# Altium project Arduino_Due.PrjPCB
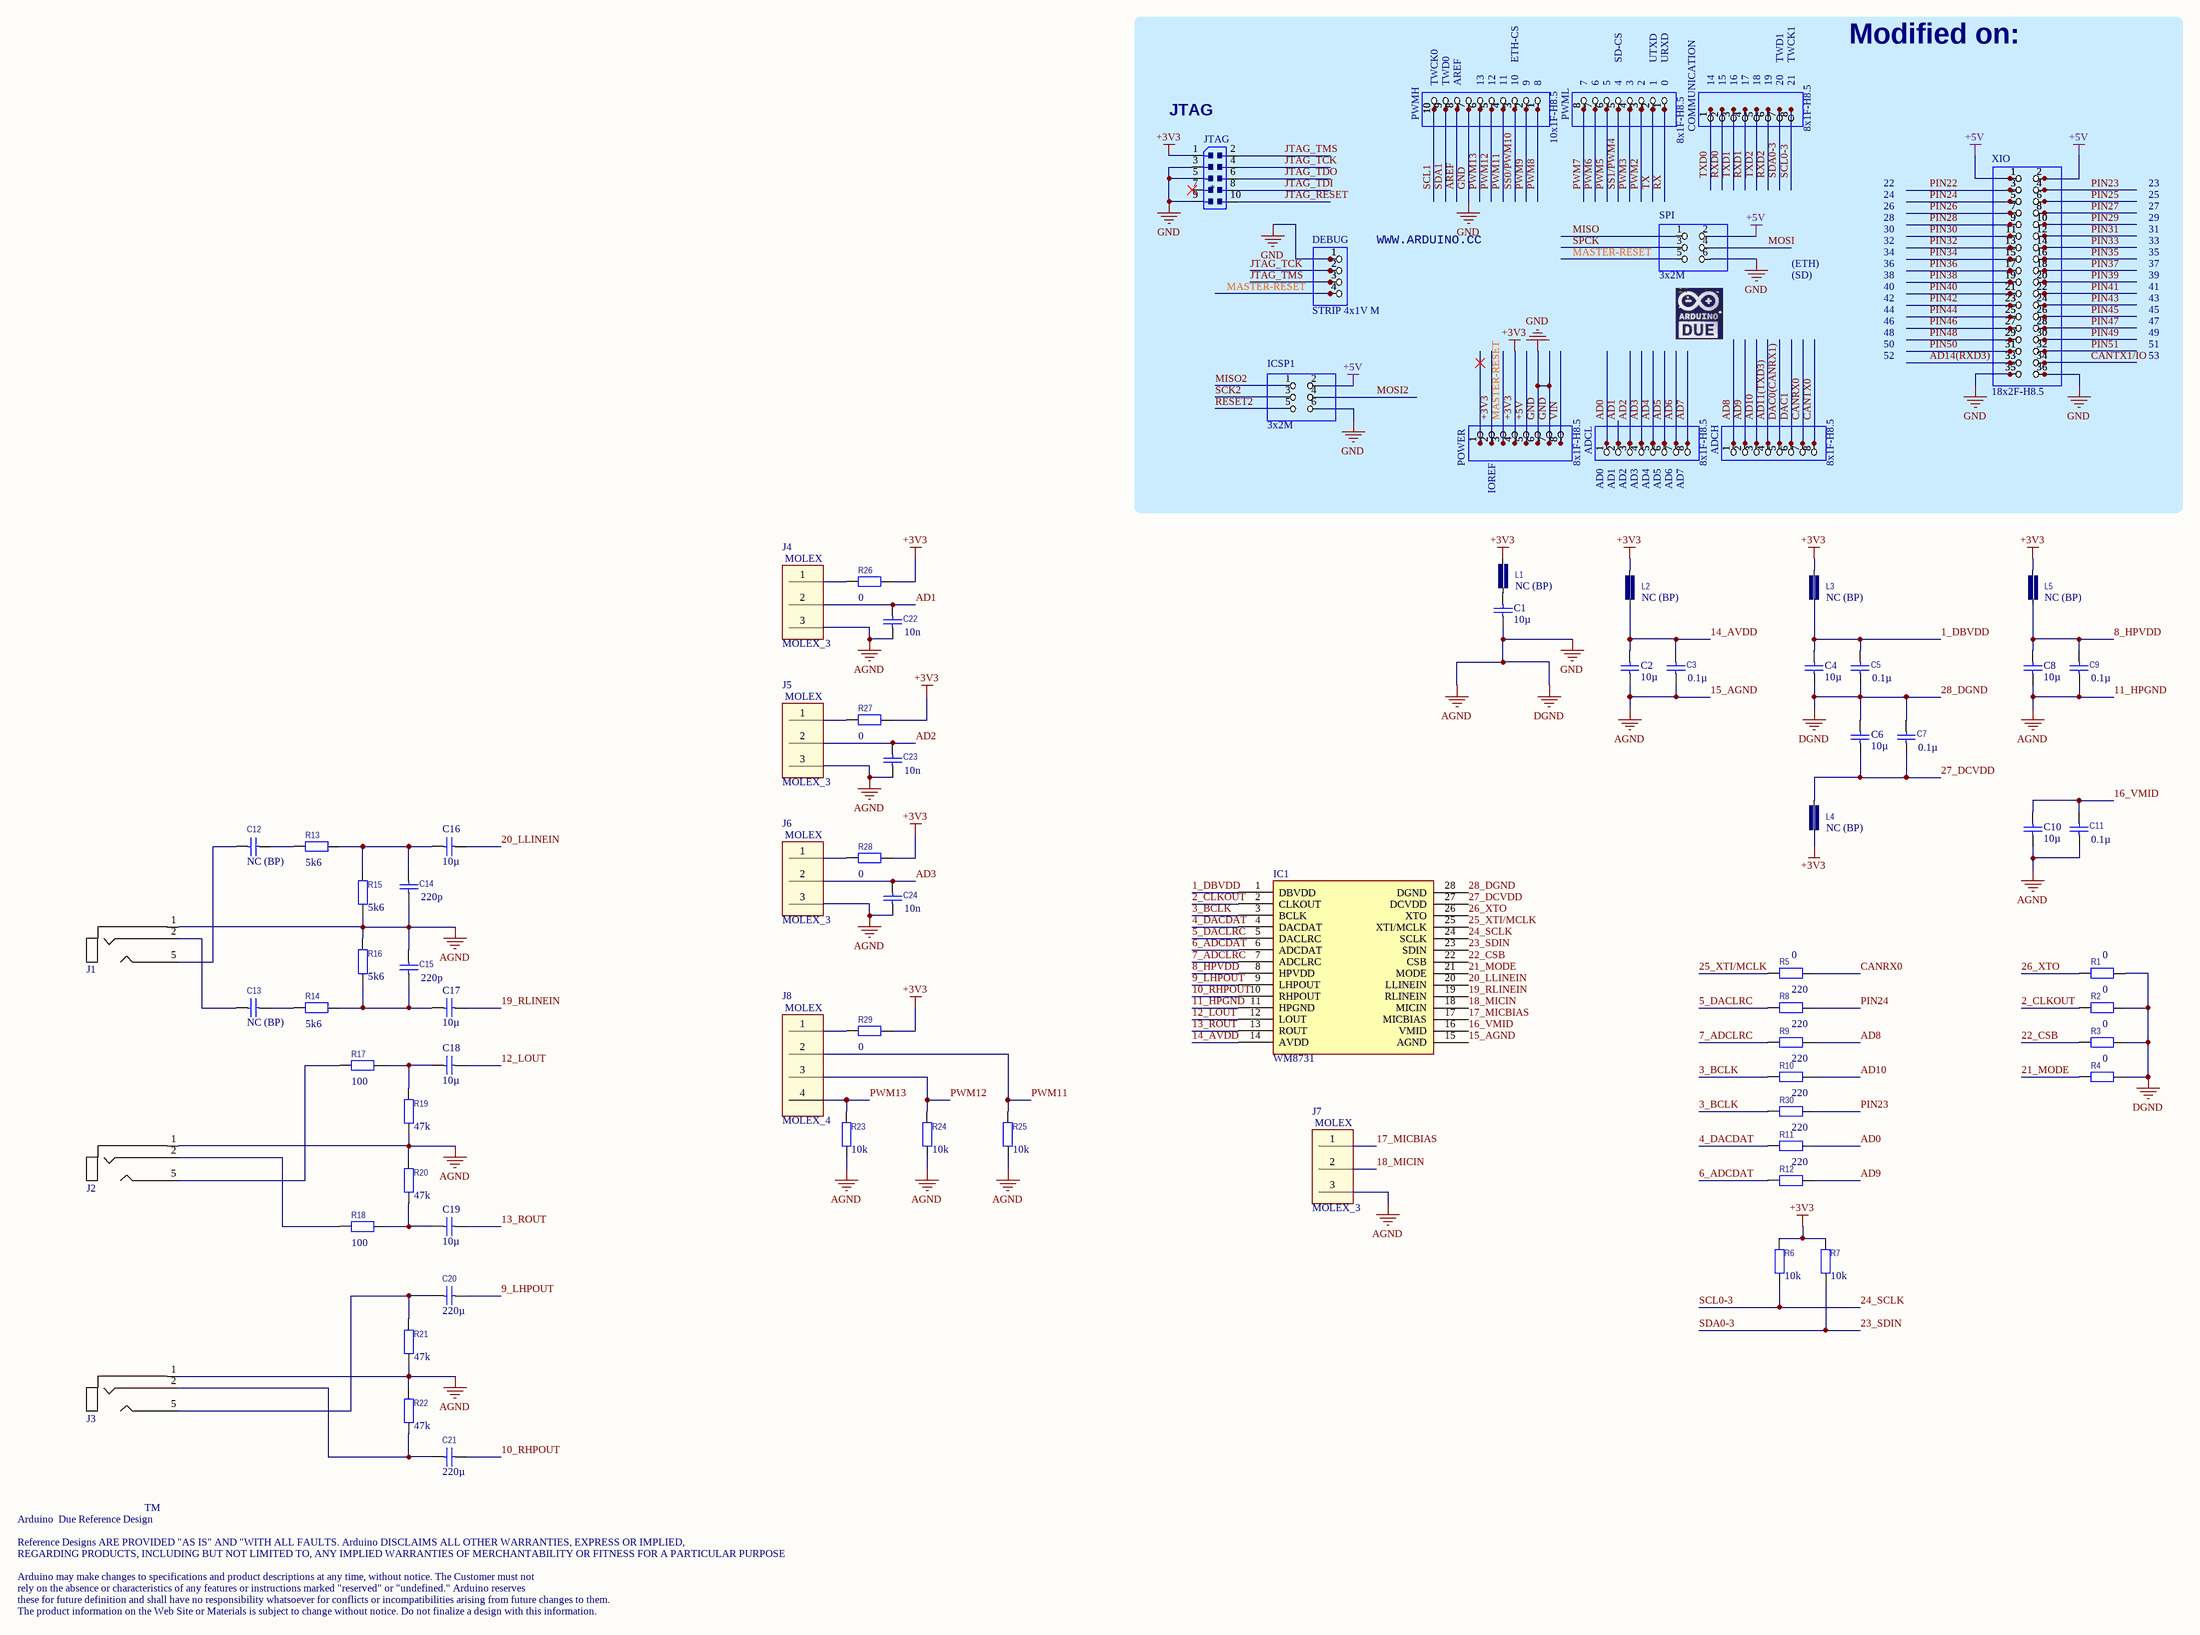
[diagram p0: Arduino_DUE_V02b_1.SchDoc]
1 sheet, 79 parts. Net scope: global (net labels, ports and power ports of the same name join across sheets).
Board file: Arduino_DUE_V02c.PcbDoc

## Sheet Arduino_DUE_V02b_1.SchDoc
size C

### Parts
ADCH  8x1F-H8.5  [1X08]
ADCL  8x1F-H8.5  [1X08]
C1  value 10µ  [0603_s]  (hidden comment: Cap)
C2  value 10µ  [0603_s]  (hidden comment: Cap)
C3  value 0.1µ  [0402_s]  (hidden comment: Capacitor)
C4  value 10µ  [0603_s]  (hidden comment: Cap)
C5  value 0.1µ  [0402_s]  (hidden comment: Capacitor)
C6  value 10µ  [0603_s]  (hidden comment: Cap)
C7  value 0.1µ  [0402_s]  (hidden comment: Capacitor)
C8  value 10µ  [0603_s]  (hidden comment: Cap)
C9  value 0.1µ  [0402_s]  (hidden comment: Capacitor)
C10  value 10µ  [0603_s]  (hidden comment: Cap)
C11  value 0.1µ  [0402_s]  (hidden comment: Capacitor)
C12  value NC (BP)  [0402_s]  (hidden comment: Capacitor)
C13  value NC (BP)  [0402_s]  (hidden comment: Capacitor)
C14  value 220p  [0402_s]  (hidden comment: Capacitor)
C15  value 220p  [0402_s]  (hidden comment: Capacitor)
C16  value 10µ  [0603_s]  (hidden comment: Cap)
C17  value 10µ  [0603_s]  (hidden comment: Cap)
C18  value 10µ  [0603_s]  (hidden comment: Cap)
C19  value 10µ  [0603_s]  (hidden comment: Cap)
C20  value 220µ  [EEEFK0J221P]  (hidden comment: Capacitor)
C21  value 220µ  [EEEFK0J221P]  (hidden comment: Capacitor)
C22  value 10n  [0402_s]  (hidden comment: Capacitor)
C23  value 10n  [0402_s]  (hidden comment: Capacitor)
C24  value 10n  [0402_s]  (hidden comment: Capacitor)
COMMUNICATION  8x1F-H8.5  [1X08]
DEBUG  STRIP 4x1V M  [1X04]
IC1  WM8731  [SSOP28]
ICSP1  3x2M  [2X03]
J1  FC68131  [FC68131]  (value not drawn)
J2  FC68131  [FC68131]  (value not drawn)
J3  FC68131  [FC68131]  (value not drawn)
J4  MOLEX_3  [254_3]
J5  MOLEX_3  [254_3]
J6  MOLEX_3  [254_3]
J7  MOLEX_3  [254_3]
J8  MOLEX_4  [254_4]
JTAG  *  [PINHEAD_2X05_127]
L1  value NC (BP)  [0402_S]
L2  value NC (BP)  [0402_S]
L3  value NC (BP)  [0402_S]
L4  value NC (BP)  [0402_S]
L5  value NC (BP)  [0402_S]
POWER  8x1F-H8.5  [1X08]
PWMH  10x1F-H8.5  [1X10]
PWML  8x1F-H8.5  [1X08]
R1  value 0  [0402_s]
R2  value 0  [0402_s]
R3  value 0  [0402_s]
R4  value 0  [0402_s]
R5  value 0  [0402_s]
R6  value 10k  [0402_s]
R7  value 10k  [0402_s]
R8  value 220  [0402_s]
R9  value 220  [0402_s]
R10  value 220  [0402_s]
R11  value 220  [0402_s]
R12  value 220  [0402_s]
R13  value 5k6  [0402_s]
R14  value 5k6  [0402_s]
R15  value 5k6  [0402_s]
R16  value 5k6  [0402_s]
R17  value 100  [0402_s]
R18  value 100  [0402_s]
R19  value 47k  [0402_s]
R20  value 47k  [0402_s]
R21  value 47k  [0402_s]
R22  value 47k  [0402_s]
R23  value 10k  [0402_s]
R24  value 10k  [0402_s]
R25  value 10k  [0402_s]
R26  value 0  [0402_s]
R27  value 0  [0402_s]
R28  value 0  [0402_s]
R29  value 0  [0402_s]
R30  value 220  [0402_s]
SPI  3x2M  [2X03]
XIO  18x2F-H8.5  [2X18]

### Blocks framed on the sheet
Modified on:: ADCH ADCL COMMUNICATION DEBUG ICSP1 JTAG POWER PWMH PWML SPI XIO

### Nets
11_HPGND: C1.1 C2.1 C3.1 C4.1 C5.1 C6.2 C7.2 C8.1 C9.1 C10.1 C11.1 C14.1 C15.2 C22.1 C23.1 C24.1 DEBUG.1 IC1.11(HPGND) IC1.15(AGND) IC1.28(DGND) ICSP1.6 J1.1 J2.1 J3.1 J4.3 J5.3 J6.3 J7.3 JTAG.3 JTAG.5 JTAG.9 POWER.6 POWER.7 PWMH.7 R1.2 R2.2 R3.2 R4.2 R15.1 R16.2 R19.1 R20.2 R21.1 R22.2 R23.1 R24.1 R25.1 SPI.6 XIO.35 XIO.36  [also labelled 15_AGND, 28_DGND, AGND, DGND, GND]
+3V3: JTAG.1 L1.2 L2.2 L3.2 L4.1 L5.2 POWER.2 POWER.4 R6.2 R7.2 R26.1 R27.1 R28.1 R29.1
+5V: ICSP1.2 POWER.5 SPI.2 XIO.1 XIO.2
1_DBVDD: C4.2 C5.2 IC1.1(DBVDD) L3.1
2_CLKOUT: IC1.2(CLKOUT) R2.1
3_BCLK: IC1.3(BCLK) R10.1 R30.1
4_DACDAT: IC1.4(DACDAT) R11.1
5_DACLRC: IC1.5(DACLRC) R8.1
6_ADCDAT: IC1.6(ADCDAT) R12.1
7_ADCLRC: IC1.7(ADCLRC) R9.1
8_HPVDD: C8.2 C9.2 IC1.8(HPVDD) L5.1
9_LHPOUT: C20.1 IC1.9(LHPOUT)
10_RHPOUT: C21.1 IC1.10(RHPOUT)
12_LOUT: C18.1 IC1.12(LOUT)
13_ROUT: C19.1 IC1.13(ROUT)
14_AVDD: C2.2 C3.2 IC1.14(AVDD) L2.1
16_VMID: C10.2 C11.2 IC1.16(VMID)
17_MICBIAS: IC1.17(MICBIAS) J7.1
18_MICIN: IC1.18(MICIN) J7.2
19_RLINEIN: C17.1 IC1.19(RLINEIN)
20_LLINEIN: C16.1 IC1.20(LLINEIN)
21_MODE: IC1.21(MODE) R4.1
22_CSB: IC1.22(CSB) R3.1
23_SDIN: COMMUNICATION.7 IC1.23(SDIN) R7.1  [also labelled SDA0-3]
24_SCLK: COMMUNICATION.8 IC1.24(SCLK) R6.1  [also labelled SCL0-3]
25_XTI/MCLK: IC1.25(XTI/MCLK) R5.1
26_XTO: IC1.26(XTO) R1.1
27_DCVDD: C6.1 C7.1 IC1.27(DCVDD) L4.2
AD0: ADCL.1 R11.2
AD1: ADCL.2 C22.2 J4.2
AD2: ADCL.3 C23.2 J5.2
AD3: ADCL.4 C24.2 J6.2
AD4: ADCL.5
AD5: ADCL.6
AD6: ADCL.7
AD7: ADCL.8
AD8: ADCH.1 R9.2
AD9: ADCH.2 R12.2
AD10: ADCH.3 R10.2
AD11(TXD3): ADCH.4
AD14(RXD3): XIO.33
AREF: PWMH.8
CANRX0: ADCH.7 R5.2
CANTX0: ADCH.8
CANTX1/IO: XIO.34
DAC0(CANRX1): ADCH.5
DAC1: ADCH.6
JTAG_RESET: JTAG.10
JTAG_TCK: DEBUG.2 JTAG.4
JTAG_TDI: JTAG.8
JTAG_TDO: JTAG.6
JTAG_TMS: DEBUG.3 JTAG.2
MASTER-RESET: DEBUG.4 POWER.3 SPI.5
MISO: SPI.1
MISO2: ICSP1.1
MOSI: SPI.4
MOSI2: ICSP1.4
PIN22: XIO.3
PIN23: R30.2 XIO.4
PIN24: R8.2 XIO.5
PIN25: XIO.6
PIN26: XIO.7
PIN27: XIO.8
PIN28: XIO.9
PIN29: XIO.10
PIN30: XIO.11
PIN31: XIO.12
PIN32: XIO.13
PIN33: XIO.14
PIN34: XIO.15
PIN35: XIO.16
PIN36: XIO.17
PIN37: XIO.18
PIN38: XIO.19
PIN39: XIO.20
PIN40: XIO.21
PIN41: XIO.22
PIN42: XIO.23
PIN43: XIO.24
PIN44: XIO.25
PIN45: XIO.26
PIN46: XIO.27
PIN47: XIO.28
PIN48: XIO.29
PIN49: XIO.30
PIN50: XIO.31
PIN51: XIO.32
PWM2: PWML.3
PWM3: PWML.4
PWM5: PWML.6
PWM6: PWML.7
PWM7: PWML.8
PWM8: PWMH.1
PWM9: PWMH.2
PWM11: J8.2 PWMH.4 R25.2
PWM12: J8.3 PWMH.5 R24.2
PWM13: J8.4 PWMH.6 R23.2
RESET2: ICSP1.5
RX: PWML.1
RXD0: COMMUNICATION.2
RXD1: COMMUNICATION.4
RXD2: COMMUNICATION.6
SCK2: ICSP1.3
SCL1: PWMH.10
SDA1: PWMH.9
SPCK: SPI.3
SS0/PWM10: PWMH.3
SS1/PWM4: PWML.5
TX: PWML.2
TXD0: COMMUNICATION.1
TXD1: COMMUNICATION.3
TXD2: COMMUNICATION.5
VIN: POWER.8
NetC1_2: C1.2 L1.1
NetC12_1: C12.1 R13.2
NetC12_2: C12.2 J1.5
NetC13_1: C13.1 R14.2
NetC13_2: C13.2 J1.2
NetC14_2: C14.2 C16.2 R13.1 R15.2
NetC15_1: C15.1 C17.2 R14.1 R16.1
NetC18_2: C18.2 R17.1 R19.2
NetC19_2: C19.2 R18.1 R20.1
NetC20_2: C20.2 J3.5 R21.2
NetC21_2: C21.2 J3.2 R22.1
NetJ2_2: J2.2 R18.2
NetJ2_5: J2.5 R17.2
NetJ4_1: J4.1 R26.2
NetJ5_1: J5.1 R27.2
NetJ6_1: J6.1 R28.2
NetJ8_1: J8.1 R29.2

Not connected (* = marked no-connect by the designer): JTAG 7*; POWER 1*

### Notes on the sheet
- (near PWMH) ETH-CS
- (near PWML) SD-CS
- (near PWML) UTXD
- (near PWML) URXD
- TWD1
- TWCK1
- (near JTAG) JTAG
- (near PWMH) TWCK0
- (near PWMH) TWD0
- (near PWMH) AREF
- (near PWMH) 13
- (near PWMH) 12
- (near PWMH) 11
- (near PWMH) 10
- (near PWMH) 9
- (near PWMH) 8
- (near PWML) 7
- (near PWML) 6
- (near PWML) 5
- (near PWML) 4
- (near PWML) 3
- (near PWML) 2
- (near PWML) 1
- (near PWML) 0
- 14
- 15
- (near COMMUNICATION) 16
- (near COMMUNICATION) 17
- (near COMMUNICATION) 18
- (near COMMUNICATION) 19
- (near COMMUNICATION) 20
- (near COMMUNICATION) 21
- 22
- 23
- (near DEBUG) WWW.ARDUINO.CC
- 24
- 26
- 28
- 30
- 32
- 25
- 27
- 29
- 31
- 33
- (ETH)
- (SD)
- 34
- 36
- 42
- 40
- 38
- 35
- 37
- 43
- 41
- 39
- 52
- 50
- 48
- 46
- 44
- 51
- 53
- 49
- 47
- 45
- (near POWER) IOREF
- (near ADCL) AD0
- (near ADCL) AD1
- (near ADCL) AD2
- (near ADCL) AD3
- (near ADCL) AD4
- (near ADCL) AD5
- (near ADCL) AD6
- (near ADCL) AD7
- TM
- Arduino  Due Reference Design
- Reference Designs ARE PROVIDED "AS IS" AND "WITH ALL FAULTS. Arduino DISCLAIMS ALL OTHER WARRANTIES, EXPRESS OR IMPLIED,
- REGARDING PRODUCTS, INCLUDING BUT NOT LIMITED TO, ANY IMPLIED WARRANTIES OF MERCHANTABILITY OR FITNESS FOR A PARTICULAR PURPOSE
- Arduino may make changes to specifications and product descriptions at any time, without notice. The Customer must not
- rely on the absence or characteristics of any features or instructions marked "reserved" or "undefined." Arduino reserves
- these for future definition and shall have no responsibility whatsoever for conflicts or incompatibilities arising from future changes to them.
- The product information on the Web Site or Materials is subject to change without notice. Do not finalize a design with this information.
- (in symbol MOLEX_3) MOLEX
- (in symbol MOLEX_4) MOLEX

### Library data of the parts
ADCH ADCL COMMUNICATION POWER PWML = PINHD-1X8
C3 C5 C7 C9 C11-C15 C20-C24 = EA00008430: Part_ID: 8430; Manufacturer 1: Murata Electronics; Manufacturer Part Number 1: GRM1555C1H220JZ01D; Identifier: C; Classification1: Passive Component; Classification3: Ceramic; Description-BOM: 22pF, 5%, 50V; Published By: David Mallaschitz; Time Required [min]: 5; Info1: 5 %; Info2: 50 V; Info3: 22 pF; Info4: C0G, NP0; Manufactrurer: *; Manufactrurer 1: *; Manufactrurer Ref.: *; Manufactrurer Part Number 1: *; Remark: *; Supplier 1: Digi-Key; Supplier 1 Price: *; Supplier 1 Ref.: *; Supplier Part Number 1: 490-1283-1-ND; Temp. Max: *; Temp. Min: *; PartNumber: EA00008430; Classification2: Capacitor; Status: verified; Footprint BOM: 0402_s; ComponentLink1Description: Folder; ComponentLink2Description: Datasheet; ComponentLink1URL: \\avl01\atgrz\misc\avl_dit_backup\_PROJEKTE\RE-Libraries\Part Documents\EA00008463; ComponentLink2URL: \\avl01\atgrz\misc\avl_dit_backup\_PROJEKTE\RE-Libraries\Part Documents\EA00008463\datasheet.pdf
DEBUG = PINHD-1X4
ICSP1 SPI = PINHD-2X3
JTAG = PINHEAD_PINHD-2X5PASSO127
L1-L5 = EA00008563: Part_ID: 8563; Manufacturer 1: Murata Electronics; Manufacturer Part Number 1: BLM15AG121SN1; Identifier: L; Classification1: Passive Component; Classification2: Ferrit Bead; Description-BOM: 120R, 550mA; Published By: Jean-Marc Lucchini; Time Required [min]: 5; PartNumber: EA00008563; Status: verified; Footprint BOM: 0402_S; ComponentLink1Description: Folder; ComponentLink2Description: Datasheet; ComponentLink1URL: \\avl01\atgrz\misc\avl_dit_backup\_PROJEKTE\RE-Libraries\Part Documents\EA00008563; ComponentLink2URL: \\avl01\atgrz\misc\avl_dit_backup\_PROJEKTE\RE-Libraries\Part Documents\EA00008563\L0110S0100BLM15AG_SN.pdf; Supplier 1: Digi-Key; Supplier Part Number 1: 490-1005-1-ND; Supplier Unit Price 1: 0,03
PWMH = PINHD-1X10
R1-R30 = EA00008473: Part_ID: 8473; Manufacturer 1: Panasonic; Manufacturer Part Number 1: ERJ-2RKF1331X; Identifier: R; Classification1: Passive Component; Classification3: Thick Film; Description-BOM: 1.33KR, 1%, 100ppm/K; Published By: David Mallaschitz; Time Required [min]: 5; Info1: 1 %; Info2: 100 mW; Info3: 1.33 KR; Info4: 100 ppm/K; PartNumber: EA00008473; Classification2: Resistor; Status: verified; Footprint BOM: 0402_s; ComponentLink1Description: Folder; ComponentLink2Description: Datasheet; ComponentLink1URL: \\avl01\atgrz\misc\avl_dit_backup\_PROJEKTE\RE-Libraries\Part Documents\EA00008712; ComponentLink2URL: \\avl01\atgrz\misc\avl_dit_backup\_PROJEKTE\RE-Libraries\Part Documents\EA00008712\datasheet.pdf; Supplier 1: Digi-Key; Supplier Part Number 1: P1.33KLTR-ND
XIO = PINHD-2X18